# Altium schematic sheet Temperature.SchDoc: BMP280 Sensor
size A4
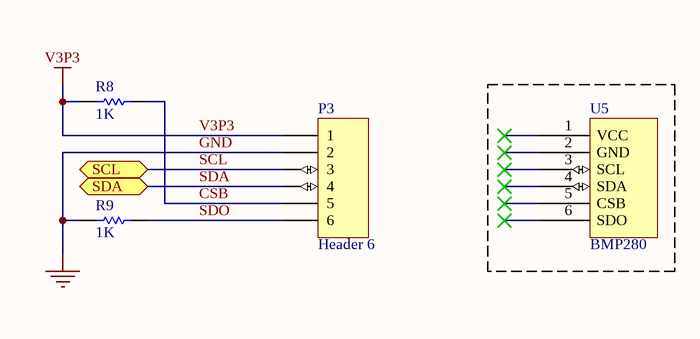
[diagram p0: Temperature.SchDoc]

## Parts
P3  Header 6  [Header 6]
R8  1K  [RES0603]
R9  1K  [RES0603]
U5  BMP280  (mechanical)

## Ports
SCL (bidir), SDA (bidir)

## Nets
GND: P3.2 R9.1
V3P3: P3.1 R8.1
CSB: P3.5 R8.2
SCL: P3.3 ; port SCL
SDA: P3.4 ; port SDA
SDO: P3.6 R9.2

Not connected (* = marked no-connect by the designer): U5 1(VCC)* 2(GND)* 3(SCL)* 4(SDA)* 5(CSB)* 6(SDO)*

## Notes on the sheet
- Title
- Size:
- Date:
- A4
- Number:
- Time:
- Revision:
- Sheet
- of
- File:

## Library data of the parts
P3 = Header 6: Header, 6-Pin; Fournisseur: Farnell; Fabricant: MULTICOMP; RefFournisseur: 1593462; RefFabricant: 2212S-06SG-85
R8 R9 = Res1: Resistor; Published: 8-Jun-2000; LatestRevisionDate: 17-Jul-2002; LatestRevisionNote: Re-released for DXP Platform.; PackageReference: AXIAL-0.3; Publisher: Altium Limited; PackageDescription: Axial Device, Thru-Hole; 2 Leads; 0.3 in Pin Spacing; Value: 1K
U5 = BMP280: Temp. sensor; Fabricant: BOSCH; RefFabricant: BMP280